# EAGLE schematic keyboard_5keys_board (EAGLE 7.1.0)
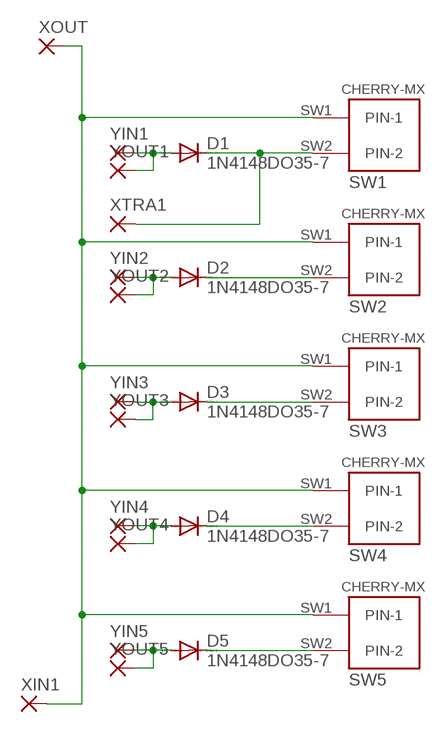
[diagram p0: schematic, sheet 1]

## Parts
D1  1N4148DO35-7  [DO35-7]
D2  1N4148DO35-7  [DO35-7]
D3  1N4148DO35-7  [DO35-7]
D4  1N4148DO35-7  [DO35-7]
D5  1N4148DO35-7  [DO35-7]
SW1  CHERRY-MX  [CHERRY-MX]
SW2  CHERRY-MX  [CHERRY-MX]
SW3  CHERRY-MX  [CHERRY-MX]
SW4  CHERRY-MX  [CHERRY-MX]
SW5  CHERRY-MX  [CHERRY-MX]
XIN1  1,6/0,8  [1,6/0,8]
XOUT  1,6/0,8  [1,6/0,8]
XTRA1  1,6/0,8  [1,6/0,8]
YIN1  1,6/0,8  [1,6/0,8]
YIN2  1,6/0,8  [1,6/0,8]
YIN3  1,6/0,8  [1,6/0,8]
YIN4  1,6/0,8  [1,6/0,8]
YIN5  1,6/0,8  [1,6/0,8]
YOUT1  1,6/0,8  [1,6/0,8]
YOUT2  1,6/0,8  [1,6/0,8]
YOUT3  1,6/0,8  [1,6/0,8]
YOUT4  1,6/0,8  [1,6/0,8]
YOUT5  1,6/0,8  [1,6/0,8]

## Nets
N$1: D3.A YIN3.1(P) YOUT3.1(P)
N$2: D5.C SW5.SW2(PIN-2)
N$3: D4.C SW4.SW2(PIN-2)
N$4: D3.C SW3.SW2(PIN-2)
N$5: D1.C SW1.SW2(PIN-2) XTRA1.1(P)
N$6: D1.A YIN1.1(P) YOUT1.1(P)
N$7: D2.A YIN2.1(P) YOUT2.1(P)
N$8: D2.C SW2.SW2(PIN-2)
N$9: D4.A YIN4.1(P) YOUT4.1(P)
N$10: D5.A YIN5.1(P) YOUT5.1(P)
XOUT: SW1.SW1(PIN-1) SW2.SW1(PIN-1) SW3.SW1(PIN-1) SW4.SW1(PIN-1) SW5.SW1(PIN-1) XIN1.1(P) XOUT.1(P)

## Library data of the parts
D1-D5 = diode:1N4148: DIODE high speed (Philips)
SW1-SW5 = cherrymx:CHERRY-MX: Cherry MX series keyswitch
XIN1 XOUT XTRA1 YIN1-YIN5 YOUT1-YOUT5 = wirepad:1,6/0,8: THROUGH-HOLE PAD